# Altium schematic sheet Board-powersupply.SchDoc: =ProjectTitle
size 297 x 209 mm; Address1: Address1; Address2: Address2; Address3: Address3; Address4: Address4; SheetNumber: 6; SheetTotal: 6; Scale: 1:1; DocumentType: Схема электрическая принципиальная
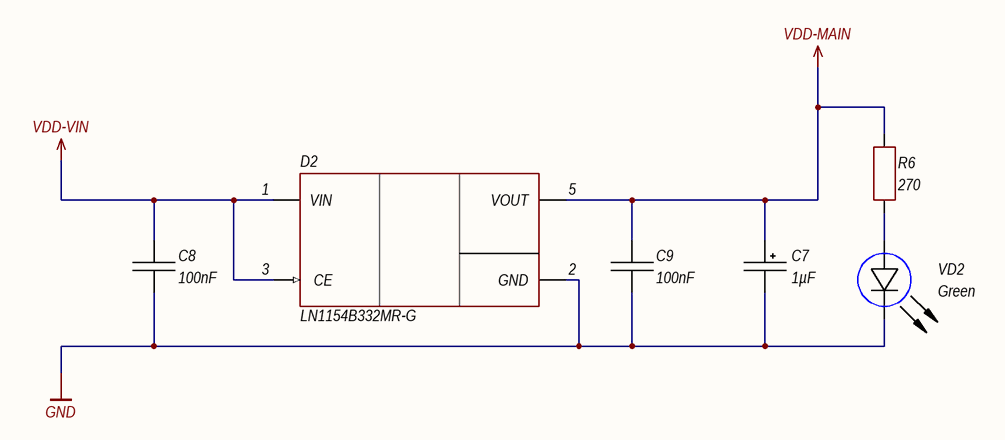
[diagram p0: Board-powersupply.SchDoc]

## Parts
C7  1µF  [TANTAL_A]
C8  100nF  [CH0603CM]
C9  100nF  [CH0603CM]
D2  LN1154B332MR-G  [SOT23-5]
R6  270  [CH0402R]
VD2  Green  [CH0402LG]

## Nets
GND: C7.2 C8.1 C9.1 D2.2(GND) VD2.2(C)
VDD-MAIN: C7.1 C9.2 D2.5(VOUT) R6.1
VDD-VIN: C8.2 D2.1(VIN) D2.3(CE)
NetR6_2: R6.2 VD2.1(A)

## Notes on the sheet
- Изм.
- Лист
- № докум.
- Подп.
- Дата
- Копировал
- Формат А4

## Library data of the parts
C7 = TantalCap: Manufacturer: *; Model: *; HelpURL: *; ComponentKind: *; Value: 1µF
C8 C9 = Capacitor: Manufacturer: CCTC; Model: TCC0402X7R104K250AT; HelpURL: https://lcsc.com/product-detail/Multilayer-Ceramic-Capacitors-MLCC-SMD-SMT_CCTC-TCC0402X7R104K250AT_C466234.html; ComponentKind: X7R, 50V; Value: 100nF
D2 = LN1154: LDO; Manufacturer: NATLINEAR; Model: LN1154B332MR-G; HelpURL: https://lcsc.com/product-detail/Dropout-Regulators-LDO_NATLINEAR-LN1154B332MR-G_C236379.html; ComponentKind: SOT-23-5, 300mA, Vin: 2-7V
R6 = Resistor: Manufacturer: YAGEO; Model: AC0402FR-07270RL; HelpURL: https://lcsc.com/product-detail/Chip-Resistor-Surface-Mount_YAGEO-AC0402FR-07270RL_C138294.html; ComponentKind: 0402 resistor; Value: 270
VD2 = LED: Manufacturer: XINGLIGHT; Model: XL-1005UGC; HelpURL: https://lcsc.com/product-detail/Light-Emitting-Diodes-LED_XINGLIGHT-XL-1005UGC_C965793.html; ComponentKind: Green led, 2.8V, 5mA; Value: Green